# EAGLE design PCB sensores nouveau (EAGLE 9.0.1)
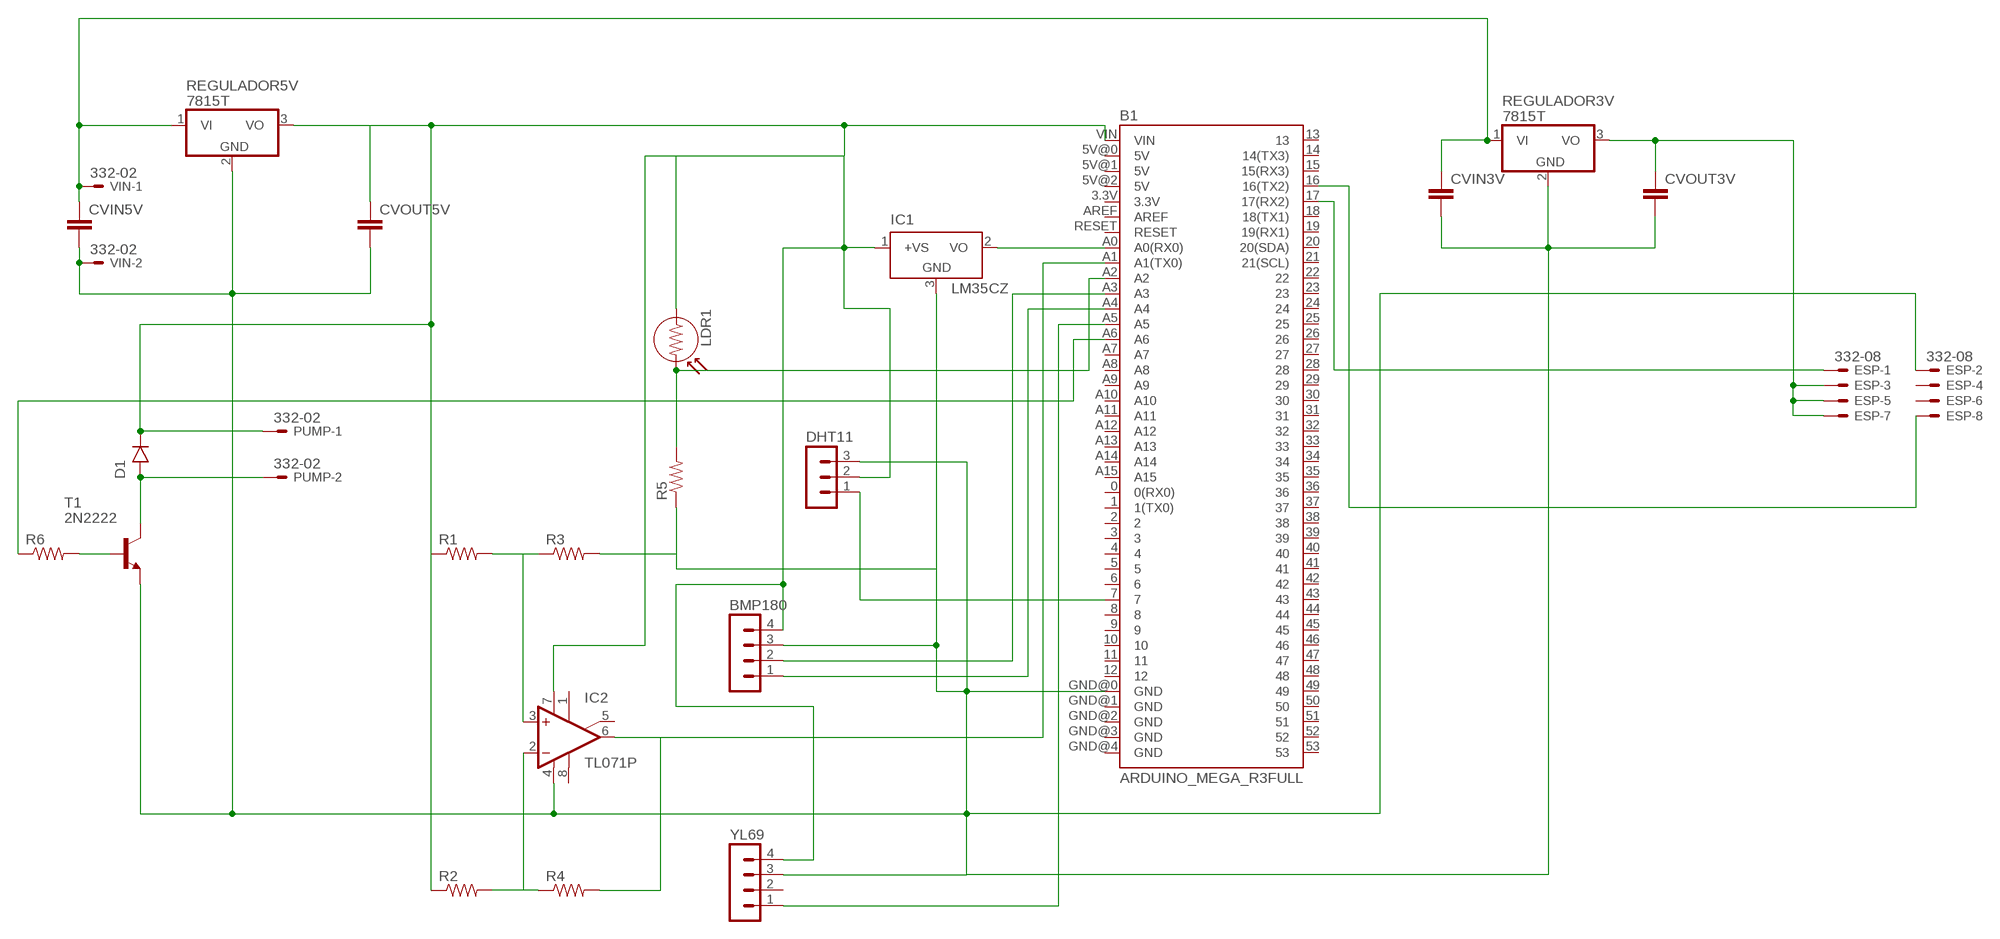
[diagram p0: schematic, sheet 1]

## Parts
B1  ARDUINO_MEGA_R3FULL  [ARDUINO_MEGA]
BMP180  MA04-1  [MA04-1]
CVIN3V  C2,5-3  [C2.5-3]
CVIN5V  C2,5-3  [C2.5-3]
CVOUT3V  C2,5-3  [C2.5-3]
CVOUT5V  C2,5-3  [C2.5-3]
D1  1N4001  [DO41-10]
DHT11  MA03-1  [MA03-1]
ESP  332-08  [332-08]
IC1  LM35CZ  [TO92]
IC2  TL071P  [DIL08]
LDR1  LDR  [LDR]
PUMP  332-02  [332-02]
R1  R-US_0207/10  [0207/10]
R2  R-US_0207/10  [0207/10]
R3  R-US_0207/10  [0207/10]
R4  R-US_0207/10  [0207/10]
R5  R-US_0207/10  [0207/10]
R6  R-US_0207/10  [0207/10]
REGULADOR3V  7815T  [TO220H]
REGULADOR5V  7815T  [TO220H]
T1  2N2222  [TO18]
VIN  332-02  [332-02]
YL69  MA04-1  [MA04-1]

## Nets
N$1: B1.GND@0(GND) BMP180.3 CVIN5V.2 CVOUT5V.2 DHT11.3 ESP.2 IC1.3(GND) IC2.4(V-) R3.2 R5.1 REGULADOR5V.2(GND) T1.1(E) VIN.2 YL69.3
N$2: B1.7 DHT11.1
N$3: IC2.2(-IN) R2.2 R4.1
N$4: B1.A2 LDR1.2 R5.2
N$5: CVOUT3V.1 ESP.3 ESP.5 ESP.7 REGULADOR3V.3(VO)
N$6: B1.A3 BMP180.2
N$7: B1.A0(A0(RX0)) IC1.2(VO)
N$8: B1.A4 BMP180.1
N$9: CVIN3V.1 CVIN5V.1 REGULADOR3V.1(VI) REGULADOR5V.1(VI) VIN.1
N$10: B1.VIN BMP180.4 CVOUT5V.1 D1.C(CATHODE) DHT11.2 IC1.1(+VS) IC2.7(V+) LDR1.1 PUMP.1 R1.1 R2.1 REGULADOR5V.3(VO) YL69.4
N$11: B1.A5 YL69.1
N$12: IC2.3(+IN) R1.2 R3.1
N$13: CVIN3V.2 CVOUT3V.2 REGULADOR3V.2(GND)
N$14: B1.A1(A1(TX0)) IC2.6(OUT) R4.2
N$15: R6.2 T1.2(B)
N$16: B1.A6 R6.1
N$17: D1.A(ANODE) PUMP.2 T1.3(C)
N$19: B1.17(17(RX2)) ESP.1
N$20: B1.16(16(TX2)) ESP.8
Unconnected: B1.0(0(RX0)) B1.1(1(TX0)) B1.2 B1.3 B1.3.3V B1.4 B1.5 B1.5V@0(5V) B1.5V@1(5V) B1.5V@2(5V) B1.6 B1.8 B1.9 B1.10 B1.11 B1.12 B1.13 B1.14(14(TX3)) B1.15(15(RX3)) B1.18(18(TX1)) B1.19(19(RX1)) B1.20(20(SDA)) B1.21(21(SCL)) B1.22 B1.23 B1.24 B1.25 B1.26 B1.27 B1.28 B1.29 B1.30 B1.31 B1.32 B1.33 B1.34 B1.35 B1.36 B1.37 B1.38 B1.39 B1.40 B1.41 B1.42 B1.43 B1.44 B1.45 B1.46 B1.47 B1.48 B1.49 B1.50 B1.51 B1.52 B1.53 B1.A7 B1.A8 B1.A9 B1.A10 B1.A11 B1.A12 B1.A13 B1.A14 B1.A15 B1.AREF B1.GND@1(GND) B1.GND@2(GND) B1.GND@3(GND) B1.GND@4(GND) B1.RESET ESP.4 ESP.6 IC2.1(ON1) IC2.5(ON2) IC2.8(OPT) YL69.2

## Library data of the parts
B1 = SparkFun-Boards:ARDUINO_MEGA_R3: Arduino Mega R3 ATmega2560 R3 compatible footprint. SparkFun Products: Arduino Mega 2560 R3 <https://www.sparkfun.com/products/11061>
BMP180 YL69 = con-lstb:MA04-1: PIN HEADER; OC_FARNELL: unknown; OC_NEWARK: unknown
CVIN3V CVIN5V CVOUT3V CVOUT5V = capacitor-wima:C: CAPACITOR naming: grid - package width
D1 = tango:1N4001: DIODE general purpose rectifier, 1 A
DHT11 = con-lstb:MA03-1: PIN HEADER; OC_FARNELL: unknown; OC_NEWARK: unknown
ESP = con-garry:332-08: 8 Pin - 2mm Dual Row Source: www.mpe-connector.de / garry_shortform_2012.pdf
IC1 = lm35:LM35: Single-Supply Centigrade Temperature Sensor Vout = (10mV/°C x Temp °C) +5mmmV Source: http://www.national.com/ds/LM/LM35.pdf
IC2 = linear:TL071: OP AMP
LDR1 = E&R_Sensores:LDR: Fotoresistencia
PUMP VIN = con-garry:332-02: 2 Pin - 2mm Dual Row Source: www.mpe-connector.de / garry_shortform_2012.pdf
R1-R5 = rcl:R-US_: RESISTOR, American symbol
R6 = resistor:R-US_: RESISTOR, American symbol
REGULADOR3V REGULADOR5V = linear:78*: Positive VOLTAGE REGULATOR Source: http://cache.national.com/ds/LM/LM78L05.pdf http://www.fairchildsemi.com/ds/LM/LM7805.pdf
T1 = transistor-neu-to92:2N2222: NPN TRANSISTOR

## Board
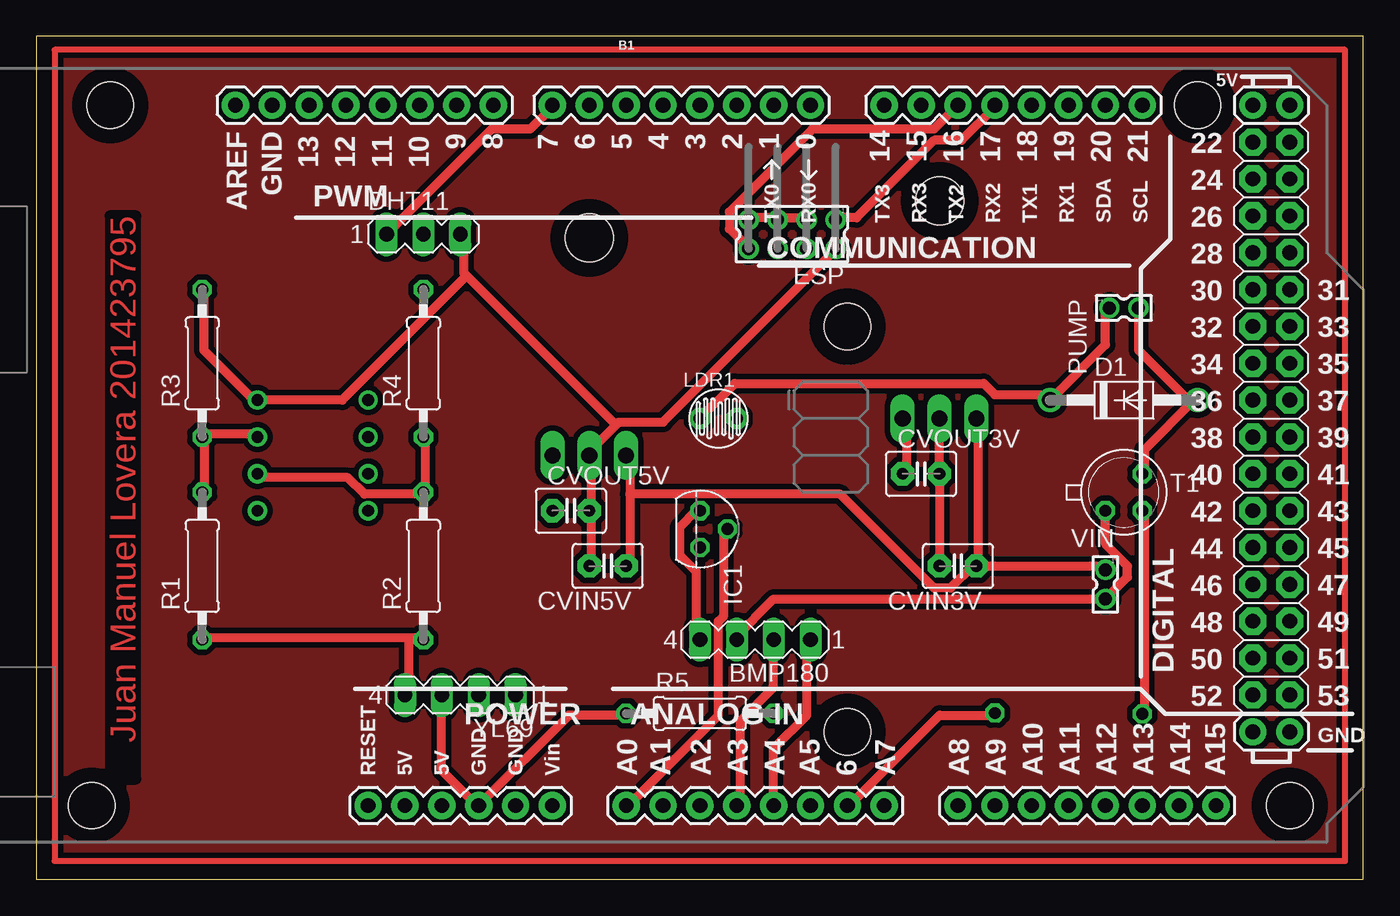
[diagram p1: board, top side]
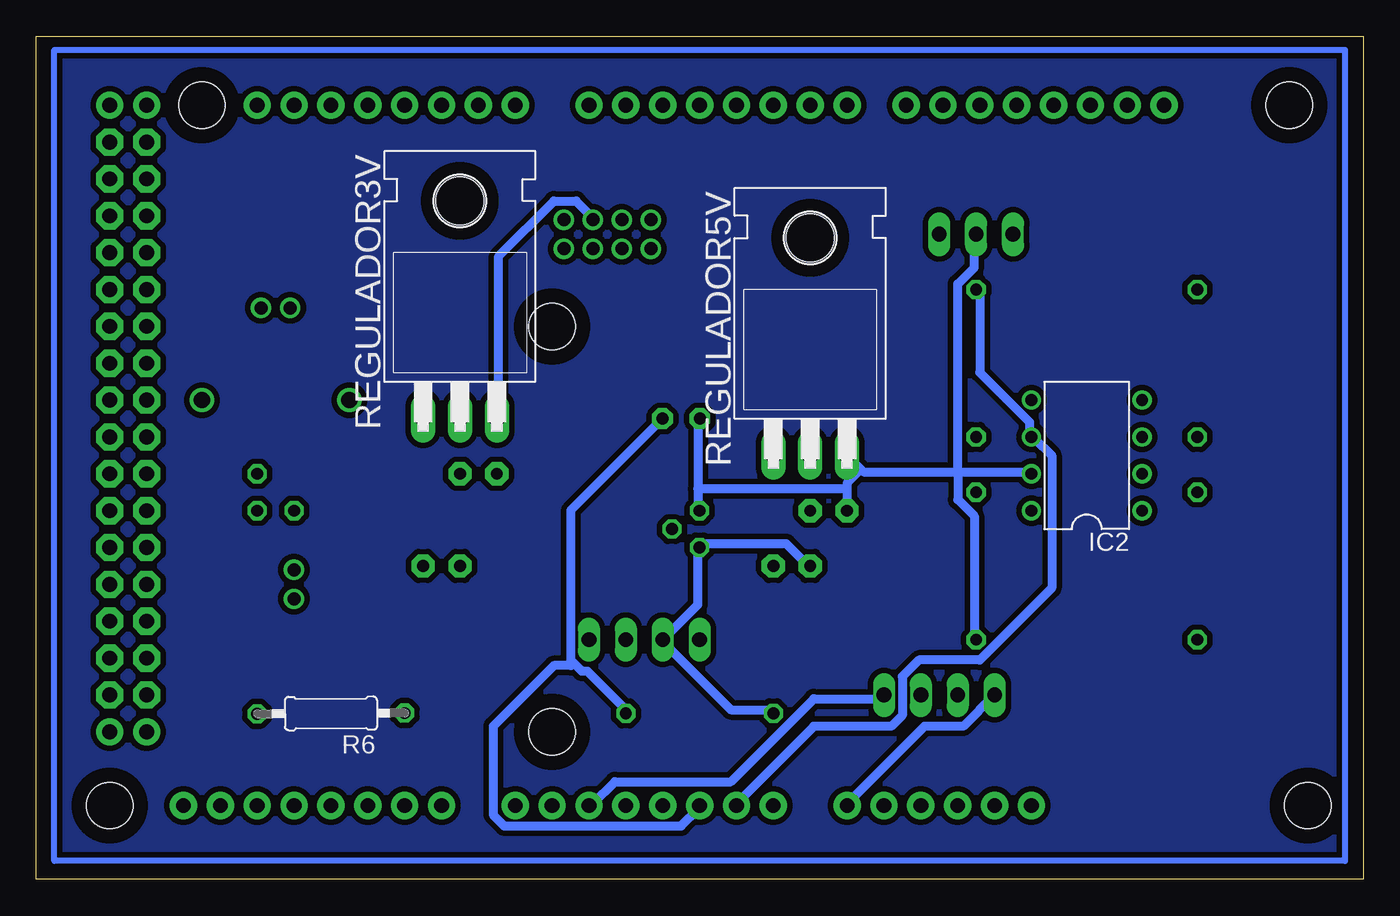
[diagram p2: board, bottom side, seen from below]

Size 91.42 x 58.09 mm. Coordinates in mm from the lower left corner, seen from the top.
Outline: 0,0 91.42,0 91.42,58.09 0,58.09 0,0
Copper layers (1*16): Top 0.035mm / dielectric 1.5mm / Bottom 0.035mm
Design rules "default *": minimum track width 6mil, minimum drill 0.35mm, track to track 15mil, track to pad 15mil, pad to pad 15mil, via to via 15mil, smd to smd 6mil, copper to edge 40mil, drill to drill 6mil, minimum pad ring 10mil, minimum via ring 8mil, stop-mask expansion 4mil, vias tented up to drill 0mil, thermal gap 10mil

### Footprints (pad centres in the part's own frame; a part is rotated, then mirrored left to right if it is on the bottom)
ARDUINO_MEGA = drill 1.016 pad 1.88: 0 13.97,24.13; 1 11.43,24.13; 2 8.89,24.13; 3 6.35,24.13; 3.3V -13.97,-24.13; 4 3.81,24.13; 5 1.27,24.13; 5V@0 -11.43,-24.13; 5V@1 44.45,24.13; 5V@2 46.99,24.13; 6 -1.27,24.13; 7 -3.81,24.13; 8 -7.874,24.13; 9 -10.414,24.13; 10 -12.954,24.13; 11 -15.494,24.13; 12 -18.034,24.13; 13 -20.574,24.13; 14 19.05,24.13; 15 21.59,24.13; 16 24.13,24.13; 17 26.67,24.13; 18 29.21,24.13; 19 31.75,24.13; 20 34.29,24.13; 21 36.83,24.13; A0 1.27,-24.13; A1 3.81,-24.13; A2 6.35,-24.13; A3 8.89,-24.13; A4 11.43,-24.13; A5 13.97,-24.13; A6 16.51,-24.13; A7 19.05,-24.13; A8 24.13,-24.13; A9 26.67,-24.13; A10 29.21,-24.13; A11 31.75,-24.13; A12 34.29,-24.13; A13 36.83,-24.13; A14 39.37,-24.13; A15 41.91,-24.13; AREF -25.654,24.13; GND@0 -8.89,-24.13; GND@1 -6.35,-24.13; GND@2 44.45,-19.05; GND@3 46.99,-19.05; GND@4 -23.114,24.13; RESET -16.51,-24.13; VIN -3.81,-24.13 | drill 1.016 pad 1.88 octagon: 22 44.45,21.59; 23 46.99,21.59; 24 44.45,19.05; 25 46.99,19.05; 26 44.45,16.51; 27 46.99,16.51; 28 44.45,13.97; 29 46.99,13.97; 30 44.45,11.43; 31 46.99,11.43; 32 44.45,8.89; 33 46.99,8.89; 34 44.45,6.35; 35 46.99,6.35; 36 44.45,3.81; 37 46.99,3.81; 38 44.45,1.27; 39 46.99,1.27; 40 44.45,-1.27; 41 46.99,-1.27; 42 44.45,-3.81; 43 46.99,-3.81; 44 44.45,-6.35; 45 46.99,-6.35; 46 44.45,-8.89; 47 46.99,-8.89; 48 44.45,-11.43; 49 46.99,-11.43; 50 44.45,-13.97; 51 46.99,-13.97; 52 44.45,-16.51; 53 46.99,-16.51 | hole 3.2: -34.29,24.13; -35.56,-24.13; 16.51,8.89; 16.51,-19.05; 40.64,24.13; 46.99,-24.13
MA04-1 = drill 1.016 long: 1 -3.81,0; 2 -1.27,0; 3 1.27,0; 4 3.81,0
C2.5-3 = drill 0.813 pad 1.6 octagon: 1 -1.27,0; 2 1.27,0
DO41-10 = drill 1.118: A 5.08,0; C -5.08,0
MA03-1 = drill 1.016 long: 1 -2.54,0; 2 0,0; 3 2.54,0
332-08 = drill 0.9 pad 1.27: 1 -3,-1; 2 -3,1; 3 -1,-1; 4 -1,1; 5 1,-1; 6 1,1; 7 3,-1; 8 3,1
TO92 = drill 0.813 octagon: 1 -1.27,0; 2 0,1.905; 3 1.27,0
DIL08 = drill 0.813 pad 1.27: 1 -3.81,-3.81; 2 -1.27,-3.81; 3 1.27,-3.81; 4 3.81,-3.81; 5 3.81,3.81; 6 1.27,3.81; 7 -1.27,3.81; 8 -3.81,3.81
LDR = drill 0.813 pad 1.422 octagon: 1 -1.29,0; 2 1.29,0
332-02 = drill 0.9 pad 1.27: 1 0,-1; 2 0,1
0207/10 = drill 0.813 octagon: 1 -5.08,0; 2 5.08,0
TO220H = drill 1.118 long: 1 -2.54,-10.16; 2 0,-10.16; 3 2.54,-10.16 | hole 3.302: 0,4.826
TO18 = drill 0.813 octagon: 1 -1.27,-1.27; 2 1.27,-1.27; 3 1.27,1.27

### Placement (x,y rotation side)
B1  39.37,29.21 0 top
BMP180  49.53,16.51 180 top
CVIN3V  63.5,21.59 180 top
CVIN5V  39.37,21.59 180 top
CVOUT3V  60.96,27.94 0 top
CVOUT5V  36.83,25.4 0 top
D1  74.93,33.02 0 top
DHT11  26.67,44.45 0 top
ESP  52.07,44.45 180 top
IC1  45.72,24.13 270 top
IC2  19.05,29.21 90 bottom
LDR1  46.99,31.75 0 top
PUMP  74.93,39.37 270 top
R1  11.43,21.59 90 top
R2  26.67,21.59 90 top
R3  11.43,35.56 90 top
R4  26.67,35.56 90 top
R5  45.72,11.43 0 top
R6  71.12,11.43 180.3 bottom
REGULADOR3V  62.23,41.91 0 bottom
REGULADOR5V  38.1,39.37 0 bottom
T1  74.93,26.67 0 top
VIN  73.66,20.32 180 top
YL69  29.21,12.7 180 top

### Tracks (layer width: path | path; a pad name or v marks a point on that pad's centre or on a via)
N$1
  Top 0.61: YL69.3 27.94,7.49 30.23,5.21 B1.GND@0 36.7,11.3 40.51,11.3 R5.1 | T1.1 73.66,23.11 75.18,21.59 75.18,20.83 73.66,19.3 | 73.66,19.3 50.8,19.3 48.13,16.64 BMP180.3 | 73.66,19.3 VIN.2 | R3.2 11.56,40.64 11.56,36.45 14.99,33.02 IC2.4 21.08,33.02 29.65,41.59 | 38.23,25.4 38.23,21.59 CVIN5V.2 | 39.94,31.3 37.85,29.21 REGULADOR5V.2 38.23,29.21 38.23,25.4 | 39.94,31.3 40.13,31.5 43.18,31.5 54.99,43.31 ESP.2 | 39.94,31.3 29.65,41.59 | 29.65,41.59 29.46,41.78 29.46,44.45 DHT11.3 | 38.23,25.4 CVOUT5V.2
  Bottom 0.61: R5.1 40.89,11.68 43.56,11.68 48.13,16.26 BMP180.3 45.85,18.92 45.85,22.73 IC1.3 45.47,23.11 39.75,23.11 38.23,21.59 CVIN5V.2
N$2
  Top 0.61: DHT11.1 31.37,51.69 34.04,51.69 35.56,53.21 B1.7
N$3
  Top 0.61: R4.1 26.8,30.35 26.8,26.92 R2.2 26.42,26.54 22.61,26.54 21.46,27.69 15.37,27.69 IC2.2
N$4
  Bottom 0.61: 54.42,14.92 54.61,15.11 54.61,25.4 48.51,31.5 LDR1.2 | 54.42,14.92 53.85,14.35 53.47,14.35 50.8,11.68 R5.2 | B1.A2 45.85,4.83 46.99,3.68 59.18,3.68 59.94,4.45 59.94,10.54 55.75,14.73 54.61,14.73 54.42,14.92
N$5
  Top 0.61: ESP.7 49.28,45.59 50.8,45.59 ESP.5 51.18,45.59 52.7,45.59 ESP.3 | CVOUT3V.1 59.94,28.07 59.94,31.5 REGULADOR3V.3
  Bottom 0.61: ESP.3 53.09,45.59 54.23,46.74 55.75,46.74 59.56,42.93 59.56,31.88 REGULADOR3V.3
N$6
  Top 0.61: BMP180.2 50.8,13.21 48.51,10.92 48.51,5.21 B1.A3
N$7
  Top 0.61: IC1.2 47.37,23.88 47.37,18.16 46.99,17.78 46.99,11.3 40.89,5.21 B1.A0
N$8
  Top 0.61: B1.A4 50.8,9.02 53.09,11.3 53.09,16.26 BMP180.1
N$9
  Top 0.61: 40.89,26.54 40.89,29.21 REGULADOR5V.1 | 40.89,26.54 40.89,21.59 CVIN5V.1 | 64.9,21.59 73.66,21.59 VIN.1 | 64.9,21.59 64.9,31.5 REGULADOR3V.1 | 64.9,21.59 CVIN3V.1 64.52,21.59 62.99,20.07 61.85,20.07 55.37,26.54 40.89,26.54
N$10
  Top 0.61: 25.65,16.64 26.42,16.64 R2.1 | 25.65,16.64 11.56,16.64 R1.1 | 25.65,16.64 25.65,12.83 YL69.4 | PUMP.1 73.66,39.12 73.66,36.83 D1.C 69.85,33.4 66.04,33.4 65.28,34.16 48.13,34.16 45.85,31.88 LDR1.1 | BMP180.4 45.47,16.64 45.47,21.21 44.32,22.35 44.32,24.26 45.47,25.4 IC1.1
  Bottom 0.61: YL69.4 27.56,10.54 30.23,10.54 35.56,5.21 B1.VIN | 27.94,28.07 34.42,28.07 REGULADOR5V.3 34.8,28.07 35.56,27.3 35.56,26.92 | 27.94,28.07 22.99,28.07 IC2.7 | 27.94,28.07 27.94,41.02 26.8,42.16 26.8,44.45 DHT11.2 | 35.56,26.92 CVOUT5V.1 | 45.85,26.92 45.85,31.5 LDR1.1 | 45.85,26.92 45.85,25.4 IC1.1 | 45.85,26.92 35.56,26.92 | 27.94,28.07 27.94,26.16 26.8,25.02 26.8,16.64 R2.1
N$11
  Bottom 0.61: YL69.1 33.27,12.45 37.85,12.45 43.56,6.73 51.56,6.73 53.09,5.21 B1.A5
N$12
  Top 0.61: R1.2 11.56,26.92 11.56,30.35 R3.1 11.56,30.73 14.99,30.73 IC2.3
N$13
  Top 0.61: CVIN3V.2 CVOUT3V.2 REGULADOR3V.2
N$14
  Bottom 0.61: R4.2 26.42,40.64 26.42,34.92 22.99,31.5 22.99,30.73 IC2.6 22.61,30.35 21.46,29.21 21.46,20.07 26.42,15.11 30.61,15.11 31.75,13.97 31.75,11.3 32.51,10.54 37.85,10.54 43.18,5.21 B1.A1
N$15
  Top 0.61: R6.2 76.33,11.68 76.33,25.4 T1.2
N$16
  Top 0.61: R6.1 66.04,11.3 62.23,11.3 56.13,5.21 B1.A6
N$17
  Top 0.61: T1.3 76.33,28.07 76.33,29.59 79.76,33.02 D1.A 79.38,33.02 75.95,36.45 75.95,39.12 PUMP.2
N$18
  Bottom 0.406: 1.27,57.15 1.27,1.27 90.17,1.27 90.17,57.15 1.27,57.15
N$19
  Top 0.61: ESP.1 55.37,45.59 56.52,45.59 61.85,50.93 63.75,50.93 66.04,53.21 B1.17
N$20
  Top 0.61: B1.16 61.85,51.69 53.47,51.69 47.75,45.97 47.75,44.83 48.9,43.69 ESP.8
N$21
  Top 0.406: 1.27,57.15 1.27,1.27 90.17,1.27 90.17,57.15 1.27,57.15
N$22
  pour Bottom: 1.27,57.15 1.27,1.27 90.17,1.27 90.17,57.15
N$23
  pour Top: 1.27,57.15 1.27,1.27 90.17,1.27 90.17,57.15

### Text on the board
Top: Juan Manuel Lovera 201423795